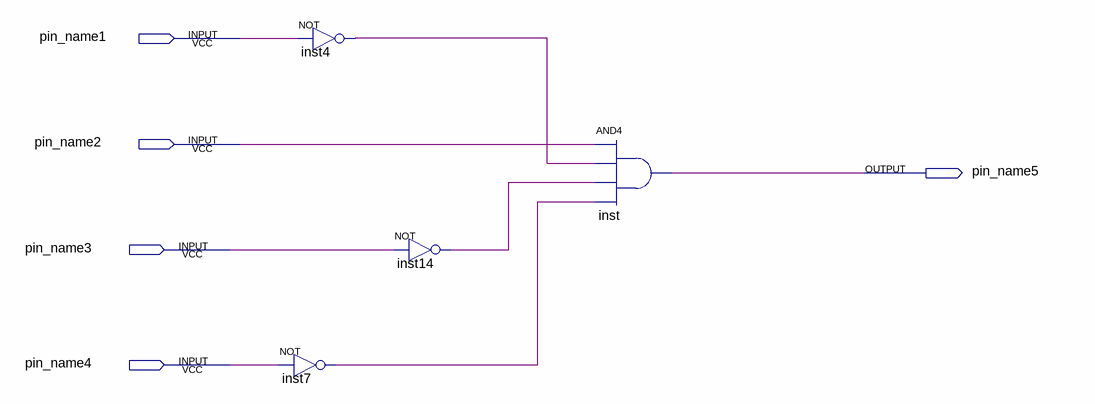
[diagram p0: schematic sheet]
// Quartus schematic c (2022_05_22 18_19_10 UTC).bdf as structural Verilog: 4 symbols, 5 pins
module \c_(2022_05_22_18_19_10_UTC)  (
  input  pin_name1,
  input  pin_name2,
  input  pin_name3,
  input  pin_name4,
  output pin_name5
);

  wire inst4_out, inst7_out, inst14_out;

  not inst4 (inst4_out, pin_name1);
  not inst7 (inst7_out, pin_name4);
  not inst14 (inst14_out, pin_name3);
  and inst (pin_name5, pin_name2, inst4_out, inst14_out, inst7_out);
endmodule
